# EAGLE design remote unit phase 3 (EAGLE 7.5.0)
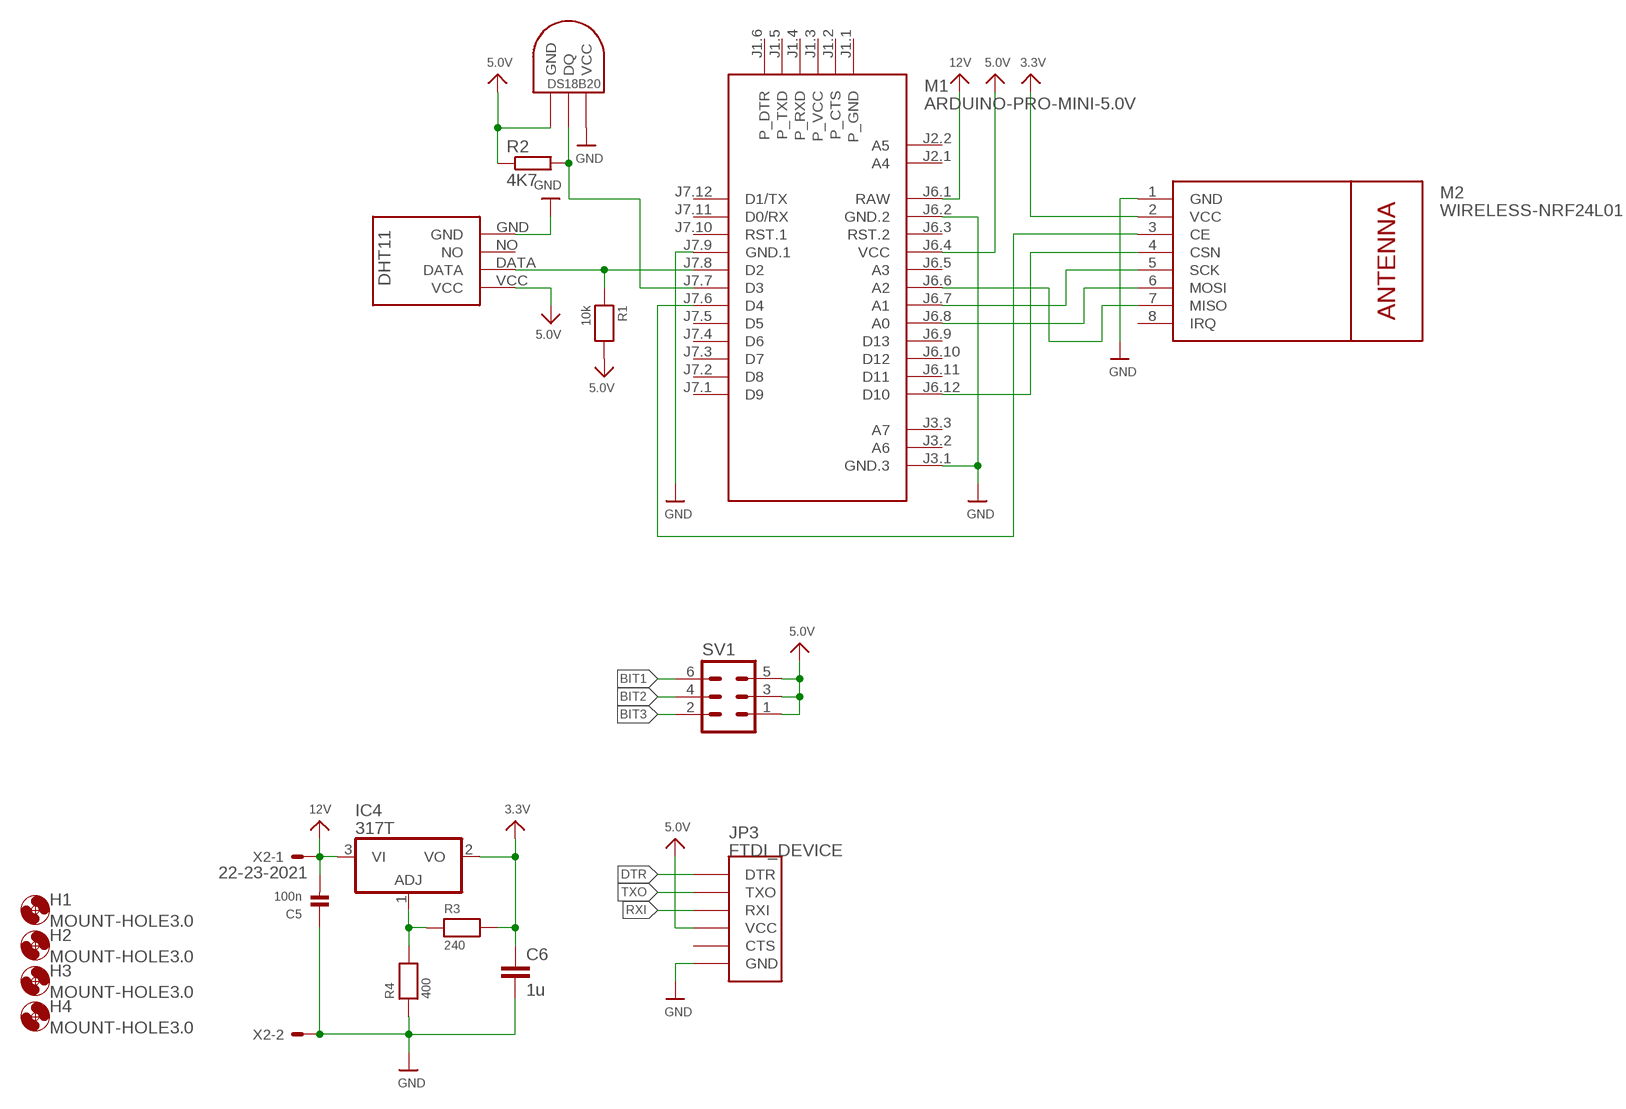
[diagram p0: schematic, sheet 1]

## Parts
C5  100n  CAP_CERAMIC_0603  [_0603]
C6  1u  C-EU050-035X075  [C050-035X075]
H1  MOUNT-HOLE3.0  [3,0]
H2  MOUNT-HOLE3.0  [3,0]
H3  MOUNT-HOLE3.0  [3,0]
H4  MOUNT-HOLE3.0  [3,0]
IC4  317T  [TO220H]
JP3  FTDI_DEVICE  [FTDI_DEVICE_SIDE]
M1  ARDUINO-PRO-MINI-5.0V  [ARDUINO-PRO-MINI]
M2  WIRELESS-NRF24L01  [WIRELESS-NRF24L01]
R1  10k  RESISTOR_0603  [_0603]
R2  4K7  R-EU_0204/5  [0204/5]
R3  240  RESISTOR_0603  [_0603]
R4  400  RESISTOR_0603  [_0603]
SV1  MA03-2  [MA03-2]
U$6  DHT11  [DHT11]
U$14  DS1820TO92  [DS1820]
X2  22-23-2021  [22-23-2021]

## Nets
3.3V: C6.1 IC4.2(VO) M2.2(VCC) R3.2
5.0V: JP3.P$4(VCC) M1.J6.4(VCC) R1.2 R2.1 SV1.1 SV1.3 SV1.5 U$6.VCC U$14.GND
12V: C5.2 IC4.3(VI) M1.J6.1(RAW) X2.1
BIT1: SV1.6
BIT2: SV1.4
BIT3: SV1.2
CE: M1.J7.6(D4) M2.3(CE)
CSN: M1.J6.12(D10) M2.4(CSN)
DHT11: M1.J7.8(D2) R1.1 U$6.DATA
DTR: JP3.P$1(DTR)
GND [vcc]: C5.1 C6.2 JP3.P$6(GND) M1.J3.1(GND.3) M1.J6.2(GND.2) M1.J7.9(GND.1) M2.1(GND) R4.1 U$6.GND U$14.VDD(VCC) X2.2
MISO: M1.J6.6(A2) M2.7(MISO)
MOSI: M1.J6.8(A0) M2.6(MOSI)
N$24: IC4.1(ADJ) R3.1 R4.2
RXI: JP3.P$3(RXI)
SCK: M1.J6.7(A1) M2.5(SCK)
TEMP: M1.J7.7(D3) R2.2 U$14.DQ
TXO: JP3.P$2(TXO)
Unconnected: JP3.P$5(CTS) M1.J1.1(P_GND) M1.J1.2(P_CTS) M1.J1.3(P_VCC) M1.J1.4(P_RXD) M1.J1.5(P_TXD) M1.J1.6(P_DTR) M1.J2.1(A4) M1.J2.2(A5) M1.J3.2(A6) M1.J3.3(A7) M1.J6.3(RST.2) M1.J6.5(A3) M1.J6.9(D13) M1.J6.10(D12) M1.J6.11(D11) M1.J7.1(D9) M1.J7.2(D8) M1.J7.3(D7) M1.J7.4(D6) M1.J7.5(D5) M1.J7.10(RST.1) M1.J7.11(D0/RX) M1.J7.12(D1/TX) M2.8(IRQ) U$6.NO

## Library data of the parts
C5 = microbuilder:CAP_CERAMIC: Ceramic Capacitors 0402 - 0402 Surface Mount Capacitors 16pF 50V 5% [Digikey: 445-4899-2-ND] 18pF 50V 5% [Digikey: 490-1281-2-ND] 22pF 50V 5% [Digikey: 490-1283-2-ND] 68pF 50V 5% [Digikey: 490-1289-2-ND] 0.1uF 10V 10% [Digikey: 490-1318-2-ND] 1.0uF 6.3V 10% [Digikey: 490-1320-2-ND] 0603 - 0603 Surface Mount Capacitors 16 pF 50V 5% [Digikey: 445-5051-2-ND] 22 pF 50V [Digikey: PCC220ACVTR-ND] 33 pF 50V 5% [Digikey: 490-1415-1-ND] 56pF 50V 5% [Digikey: 490-1421-1-ND] 220pF 50V 5% [Digikey: 445-1285-1-ND] 680 pF 50V 2200 pF 50V 5% C0G [Digikey: 445-1297-1-ND] 5600 pF 100V 5% X7R [Digikey: 478-3711-1-ND] 0.1 µF 25V 10% [Digikey: PCC2277TR-ND] 0.22 µF 16V 10% X7R [Digikey: 445-1318-1-ND] 1.0 µF 25V 10% [Digikey: 445-5146-2-ND] 0603 - RF Specific 3pF 250V +/-0.1pF RF [Digikey: 712-1347-1-ND] 18 pF 250V 5% [Digikey: 478-3505-1-ND or 712-1322-1-ND] 56 pF 250V 5% C0G RF [Digikey: 490-4867-1-ND] 68 pF 250V RF [Digikey: 490-4868-1-ND] 0805 - 0805 Surface Mount Capacitors 220 pF 250V 2% RF Ceramic Capacitor [Digikey: 712-1398-1-ND] 1000 pF 50V 2% NP0 Ceramic Capacitor [Digikey: 478-3760-1-ND] 0.1 µF 25V 10% Ceramic Capacitor [Digikey: PCC1828TR-ND] 1.0 µF 16V 10% Ceramic Capacitor[Digikey: 490-1691-2-ND] 10.0 µF 10V 10% Ceramic Capacitor[Digikey: 709-1228-1-ND] 10.0 uF 16V 10% Ceramic Capacitor [Digikey: 478-5165-2-ND] 47 uF 6.3V 20% Ceramic Capacitor [Digikey: 587-1779-1-ND or 399-5506-1-ND] 1206 - 1206 Surface Mount Capacitors 47uF 10V 20% Ceramic Capacitor [Digikey: 490-5528-1-ND or 399-5508-1-ND or 445-6010-1-ND] 100uF 6.3V -20%, +80% Y5V Ceramic Capacitor (Digikey: 490-4512-1-ND, Mouser: 81-GRM31CF50J107ZE1L)
C6 = rcl:C-EU: CAPACITOR, European symbol
H1-H4 = holes:MOUNT-HOLE: MOUNTING HOLE with drill center marker
IC4 = linear:*317: Positive VOLTAGE REGULATOR
JP3 = SparkFun-Connectors:FTDI_DEVICE: Connector which mates to FTDI basic or FTDI cable.
M1 = diy-modules:ARDUINO-PRO-MINI-*: Arduino Pro Mini
M2 = diy-modules:WIRELESS-NRF24L01: 2.4 GHz Wireless Module based on NRF24L01 chip
R1 R3 R4 = microbuilder:RESISTOR: Resistors 0402 - 0402 Surface Mount Package 22 Ohm 1% 1/16W [Digikey: 311-22.0LRTR-ND] 33 Ohm 5% 1/16W 1.0K 5% 1/16W 1.5K 5% 1/16W 2.0K 1% 1/16W 10.0K 1% 1/16W [Digikey: 311-10.0KLRTR-ND] 10.0K 5% 1/16W [Digikey: RMCF0402JT10K0TR-ND] 12.1K 1% 1/16W [Digikey: 311-22.0LRTR-ND] 100.0K 5% 1/16W 0603 - 0603 Surface Mount Package 0 Ohm 1/10 Watt 1% Resistor 15 Ohm 1/10 Watt 1% Resistor 33 Ohm 1/10 Watt 1% Resistor 49.9 Ohm 1/10 Watt 1% Resistor 100 Ohm 1/10 Watt 1% Resistor 150 Ohm 1/10 Watt 1% Resistor 240 Ohm 1/10 Watt 1% Resistor 390 Ohm 1/10 Watt 1% Resistor 560 Ohm 1/10 Watt 1% Resistor 680 Ohm 1/10 Watt 1% Resistor 750 Ohm 1/10 Watt 1% Resistor 1.0K Ohm 1/10 Watt 1% Resistor 1.5K Ohm 1/10 Watt 1% Resistor 2.0K Ohm 1/10 Watt 1% Resistor 2.2K Ohm 1/10 Watt 1% Resistor 3.3K Ohm 1/10 Watt 1% Resistor 4.7K Ohm 1/10 Watt 1% Resistor 10.0K Ohm 1/10 Watt 1% Resistor 12.0K Ohm 1/10 Watt 1% Resistor 12.1K Ohm 1/10 Watt 1% Resistor 20.0K Ohm 1/10 Watt 1% Resistor 33.0K Ohm 1/10 Watt 1% Resistor 100.0K Ohm 1/10 Watt 1% Resistor 0805 - 0805 Surface Mount Package 0 Ohm 1/8 Watt 1% Resistor 33 Ohm 1/8 Watt 1% Resistor 100 Ohm 1/8 Watt 1% Resistor 150 Ohm 1/8 Watt 1% Resistor 200 Ohm 1/8 Watt 1% Resistor 240 Ohm 1/8 Watt 1% Resistor 330 Ohm 1/8 Watt 1% Resistor 390 Ohm 1/8 Watt 1% Resistor 470 Ohm 1/8 Watt 1% Resistor 1.0K Ohm 1/8 Watt 1% Resistor 1.5K Ohm 1/8 Watt 1% Resistor 2.0K Ohm 1/8 Watt 1% Resistor 4.7K Ohm 1/8 Watt 1% Resistor 5.1K Ohm 1/8 Watt 1% Resistor 5.6K Ohm 1/8 Watt 1% Resistor 10.0K Ohm 1/8 Watt 1% Resistor 22.0K Ohm 1/8 Watt 1% Resistor 33.0K Ohm 1/8 Watt 1% Resistor 100K Ohm 1/8 Watt 1% Resistor 1206 - 1206 Surface Mount Package 2012 - 2010 Surface Mount Package 0.11 Ohm 1/2 Watt 1% Resistor - Digikey: RHM.11UCT-ND
R2 = resistor:R-EU_: RESISTOR, European symbol
SV1 = con-lstb:MA03-2: PIN HEADER; OC_FARNELL: unknown; OC_NEWARK: unknown
U$6 = DHT11:DHT11: DHT11 Czujnik temperatury i wilgotności
U$14 = Ava:DS1820: DS18B20 Programmable Resolution 1-Wire Digital Thermometer Description The DS18B20 digital thermometer provides 9-bit to 12-bit Celsius temperature measurements and has an alarm function with nonvolatile user-programmable upper and lower trigger points. The DS18B20 communicates over a 1-Wire® bus that by definition requires only one data line (and ground) for communication with a central microprocessor. It has an operating temperature range of -55°C to +125°C and is accurate to ±0.5°C over the range of -10°C to +85°C. In addition, the DS18B20 can derive power directly from the data line ("parasite power"), eliminating the need for an external power supply. Each DS18B20 has a unique 64-bit serial code, which allows multiple DS18B20s to function on the same 1-Wire bus. Thus, it is simple to use one microprocessor to control many DS18B20s distributed over a large area. Applications that can benefit from this feature include HVAC environmental controls, temperature monitoring systems inside buildings, equipment, or machinery, and process monitoring and control systems.
X2 = con-molex:22-23-2021: .100" (2.54mm) Center Header - 2 Pin; MF: MOLEX; MPN: 22-23-2021; OC_FARNELL: 1462926; OC_NEWARK: 25C3832

## Net classes
1 vcc: width 0.254 mm

## Board
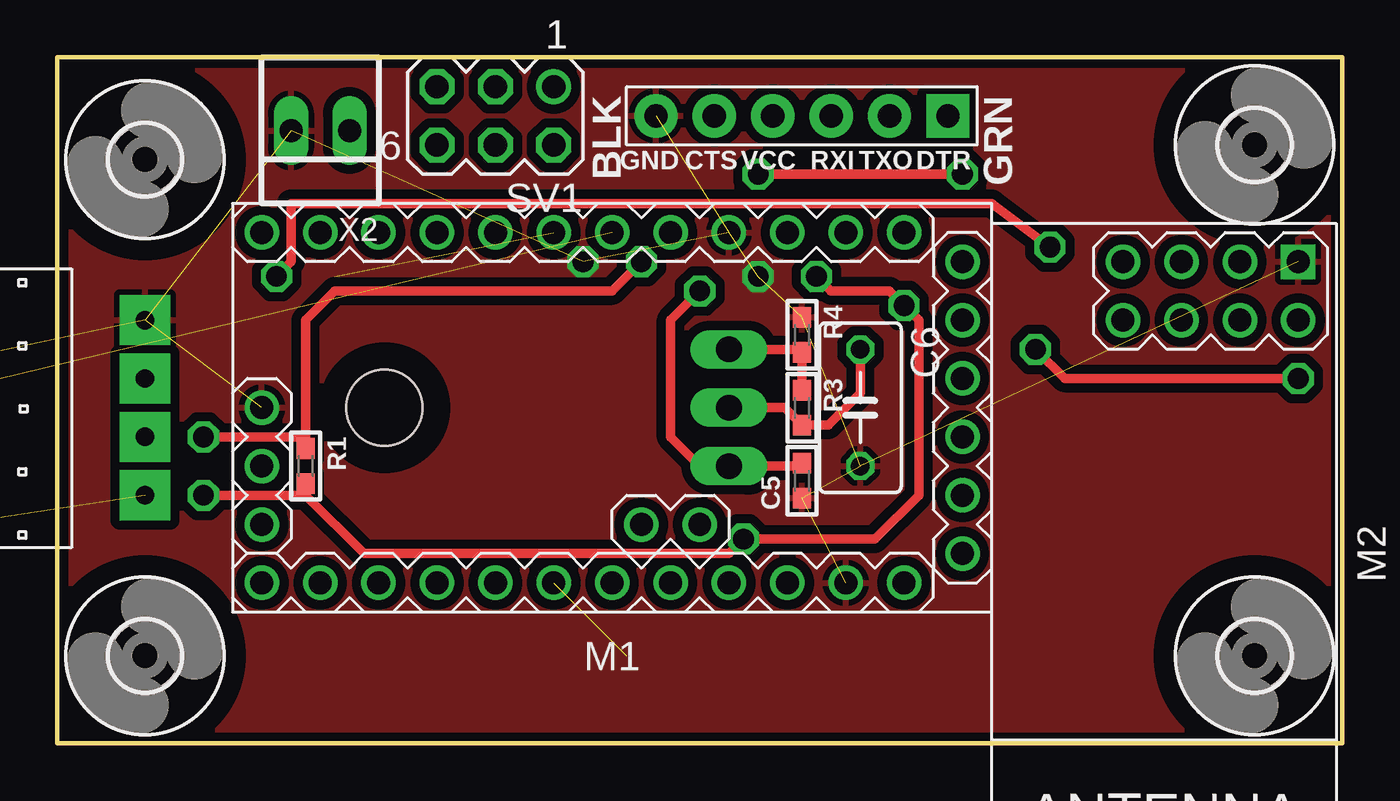
[diagram p1: board, top side]
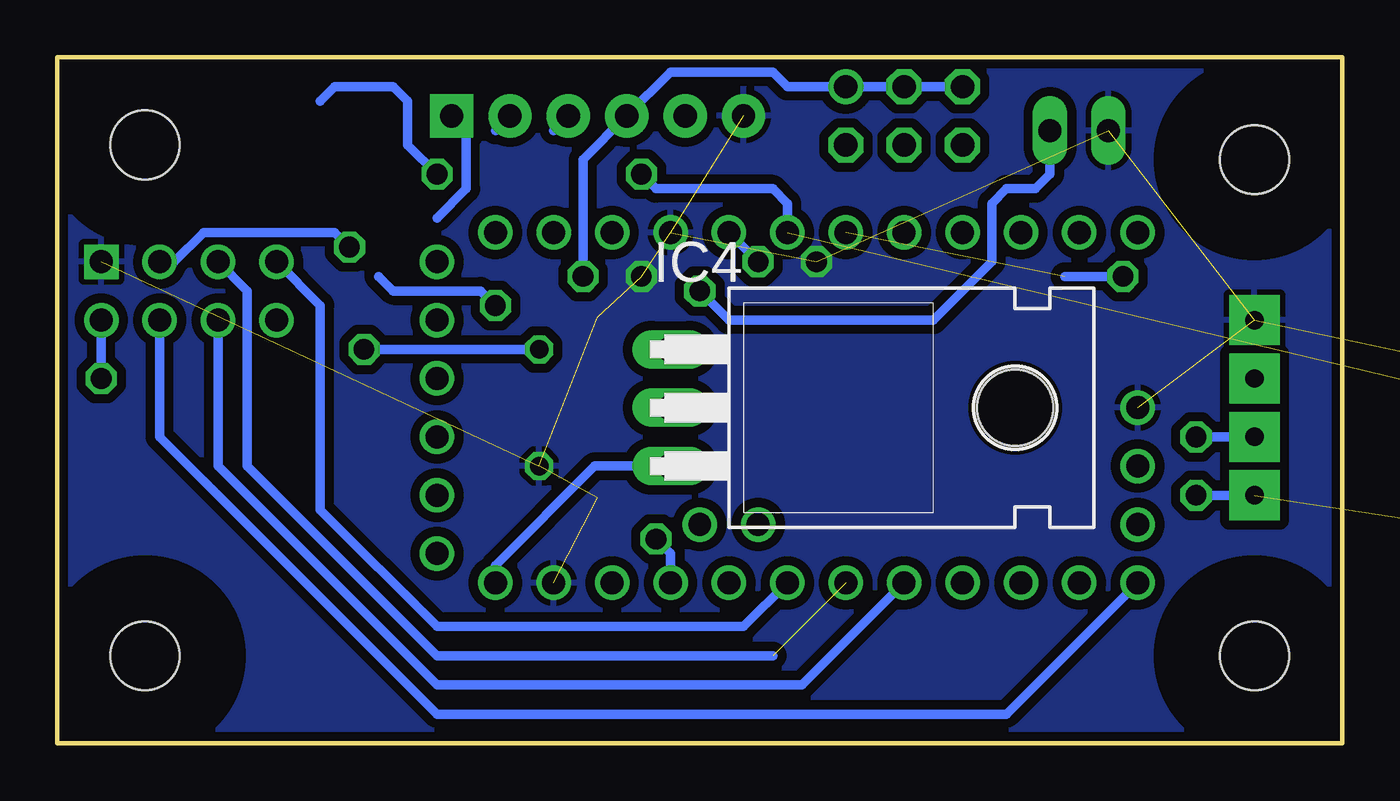
[diagram p2: board, bottom side, seen from below]

Size 55.88 x 29.85 mm. Coordinates in mm from the lower left corner, seen from the top.
Outline: 0,29.85 0,0 55.88,0 55.88,29.85 0,29.85
Copper layers (1*16): Top 0.0356mm / dielectric 1.5011mm / Bottom 0.0356mm
Design rules "LaenPCBOrder *": minimum track width 6mil, minimum drill 13mil, track to track 16mil, track to pad 16mil, pad to pad 16mil, via to via 16mil, smd to smd 16mil, copper to edge 15mil, drill to drill 6mil, minimum pad ring 7mil, minimum via ring 7mil, stop-mask expansion 3mil, vias tented up to drill 0mil, thermal gap 10mil

### Footprints (pad centres in the part's own frame; a part is rotated, then mirrored left to right if it is on the bottom)
_0603 = smd 0.9 x 0.8: 1 -0.762,0; 2 0.762,0
C050-035X075 = drill 0.813 octagon: 1 -2.54,0; 2 2.54,0
3,0 = hole 3: 0,0
TO220H = drill 1.118 long: 1 -2.54,-10.16; 2 0,-10.16; 3 2.54,-10.16 | hole 3.302: 0,4.826
FTDI_DEVICE_SIDE = drill 1.016 pad 1.88 square: P$1 -6.35,0 | drill 1.016 pad 1.88: P$2 -3.81,0; P$3 -1.27,0; P$4 1.27,0; P$5 3.81,0; P$6 6.35,0
ARDUINO-PRO-MINI = drill 1: J1.1 -15.24,6.35; J1.2 -15.24,3.81; J1.3 -15.24,1.27; J1.4 -15.24,-1.27; J1.5 -15.24,-3.81; J1.6 -15.24,-6.35; J2.1 -1.27,5.08; J2.2 -3.81,5.08; J3.1 15.24,0; J3.2 15.24,2.54; J3.3 15.24,5.08; J6.1 -12.7,7.62; J6.2 -10.16,7.62; J6.3 -7.62,7.62; J6.4 -5.08,7.62; J6.5 -2.54,7.62; J6.6 0,7.62; J6.7 2.54,7.62; J6.8 5.08,7.62; J6.9 7.62,7.62; J6.10 10.16,7.62; J6.11 12.7,7.62; J6.12 15.24,7.62; J7.1 15.24,-7.62; J7.2 12.7,-7.62; J7.3 10.16,-7.62; J7.4 7.62,-7.62; J7.5 5.08,-7.62; J7.6 2.54,-7.62; J7.7 0,-7.62; J7.8 -2.54,-7.62; J7.9 -5.08,-7.62; J7.10 -7.62,-7.62; J7.11 -10.16,-7.62; J7.12 -12.7,-7.62
WIRELESS-NRF24L01 = drill 1 square: 1 -12.7,6.35 | drill 1: 2 -10.16,6.35; 3 -12.7,3.81; 4 -10.16,3.81; 5 -12.7,1.27; 6 -10.16,1.27; 7 -12.7,-1.27; 8 -10.16,-1.27
0204/5 = drill 0.813 octagon: 1 -2.54,0; 2 2.54,0
MA03-2 = drill 1.016: 1 -2.54,-1.27 | drill 1.016 octagon: 2 -2.54,1.27; 3 0,-1.27; 4 0,1.27; 5 2.54,-1.27; 6 2.54,1.27
DHT11 = drill 0.8 pad 2.184 square: DATA -1.27,-11.43; GND 3.81,-11.43; NO 1.27,-11.43; VCC -3.81,-11.43
DS1820 = drill 0.8: DQ 2.54,-1.27; GND 0.635,-1.27; VDD 4.445,-1.27
22-23-2021 = drill 1 long: 1 -1.27,0; 2 1.27,0

### Placement (x,y rotation side)
C5  32.38,11.43 90 top
C6  34.92,14.61 270 top
H1  3.81,3.81 0 top
H2  3.81,25.4 0 top
H3  52.07,3.81 0 top
H4  52.07,26.04 0 top
IC4  19.05,14.61 270 bottom
JP3  32.38,27.31 180 top
M1  24.13,14.61 180 top
M2  47.62,8.26 270 top
R1  10.79,12.06 270 top
R2  -135.25,-15.24 0 top  (outside the outline)
R3  32.38,14.61 270 top
R4  32.38,17.78 270 top
SV1  19.05,27.31 180 top
U$6  -7.62,14.61 90 top
U$14  -137.8,-9.53 0 top  (outside the outline)
X2  11.43,26.67 180 top

### Tracks (layer width: path | path; a pad name or v marks a point on that pad's centre or on a via)
3.3V  (via drill 0.9)
  Top 0.406: IC4.2 31.62,14.61 R3.2 33.53,13.84 34.92,15.24 C6.1 | v42.55,17.15 43.82,15.88 v53.98,15.88
  Bottom 0.406: C6.1 v42.55,17.15 | v53.98,15.88 M2.2
5.0V  (via drill 0.9)  (2 unrouted)
  Top 0.406: 10.79,10.79 13.34,8.26 29.21,8.26 v29.84,8.89 35.56,8.89 37.46,10.79 37.46,18.42 v36.83,19.05 36.2,19.69 33.66,19.69 v33.02,20.32 | R1.2 10.79,10.79 | v6.35,10.79 10.79,10.79
  Bottom 0.406: v33.02,20.32 33.02,25.4 JP3.P$4 29.21,29.21 24.77,29.21 24.13,28.58 SV1.1 SV1.3 SV1.5 | 41.91,20.32 41.27,19.69 37.46,19.69 v36.83,19.05 | U$6.VCC v6.35,10.79 | M1.J6.4 29.21,8.26 v29.84,8.89
12V  (via drill 0.9)
  Top 0.406: C5.2 32.26,12.06 IC4.3 27.94,12.06 26.67,13.33 26.67,18.42 v27.94,19.69
  Bottom 0.406: X2.1 12.7,24.77 13.34,24.13 14.61,24.13 15.24,23.5 15.24,20.96 17.78,18.42 26.67,18.42 v27.94,19.69 | M1.J6.1 36.83,7.75 32.51,12.06 IC4.3
CE  (via drill 0.9)  (1 unrouted)
  Top 0.406: v43.18,21.59 40.64,23.5 10.16,23.5 10.16,20.96 v9.52,20.32
  Bottom 0.406: v43.18,21.59 43.82,22.23 49.53,22.23 50.8,20.96 M2.3 | v9.52,20.32 12.06,20.32
CSN
  Bottom 0.406: M1.J6.12 14.61,1.27 39.37,1.27 51.44,13.33 M2.4
DHT11  (via drill 0.9)
  Top 0.406: R1.1 10.79,13.33 | 10.79,13.33 10.79,18.42 12.06,19.69 24.13,19.69 v25.4,20.96 | v6.35,13.33 10.79,13.33
  Bottom 0.406: U$6.DATA v6.35,13.33 | v25.4,20.96 M1.J7.8
DTR
  Bottom 0.406: 39.37,22.86 38.1,24.13 38.1,26.67 JP3.P$1
GND  (via drill 0.9)  (12 unrouted)
  other vias: 30.48,20.32 22.86,20.96
  pour Top (isolate 0.305): 0,29.85 55.88,29.85 55.88,0 0,0
  pour Bottom (isolate 0.305): 0,29.85 55.88,29.85 55.88,0 0,0
MISO
  Bottom 0.406: M1.J6.6 26.03,5.08 39.37,5.08 44.45,10.16 44.45,19.05 M2.7
MOSI
  Bottom 0.406: M1.J6.8 23.49,2.54 39.37,2.54 48.9,12.06 M2.6
N$24
  Top 0.406: R3.1 R4.2 32.26,17.15 IC4.1
RXI
  Bottom 0.406: 34.29,26.67 JP3.P$3
SCK  (1 unrouted)
  Bottom 0.406: 24.77,3.81 39.37,3.81 47.62,12.06 47.62,19.69 M2.5
TEMP  (via drill 0.9)  (2 unrouted)
  Top 0.406: v30.48,24.77 v39.37,24.77
  Bottom 0.406: M1.J7.7 24.13,23.5 24.77,24.13 29.84,24.13 v30.48,24.77 | v39.37,24.77 40.64,26.04 40.64,27.94 41.27,28.58 43.82,28.58 44.45,27.94
TXO
  Bottom 0.406: 36.83,26.67 JP3.P$2